# EAGLE design ledboard (EAGLE 5.11)
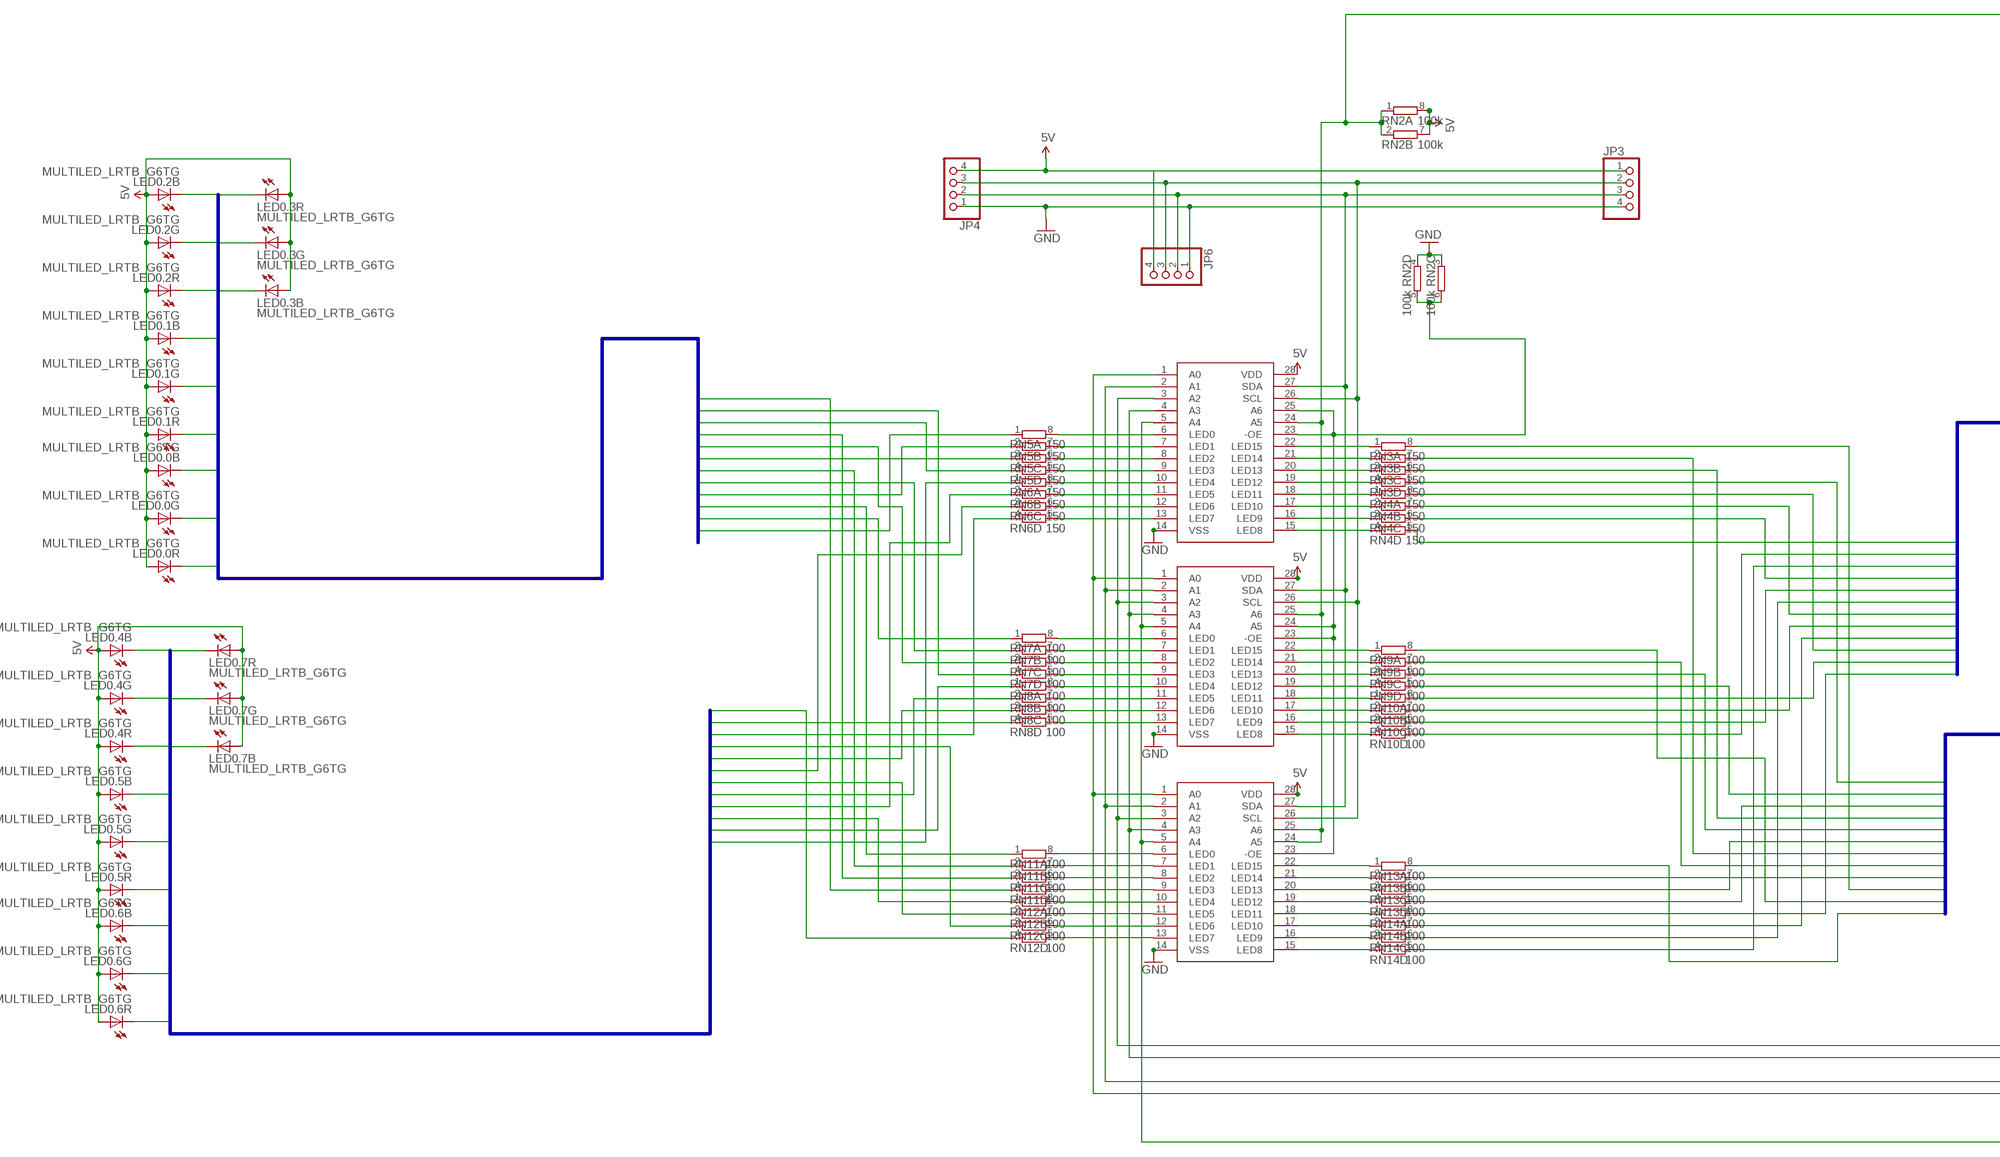
[diagram p0: schematic, sheet 1, part 1 of 2]
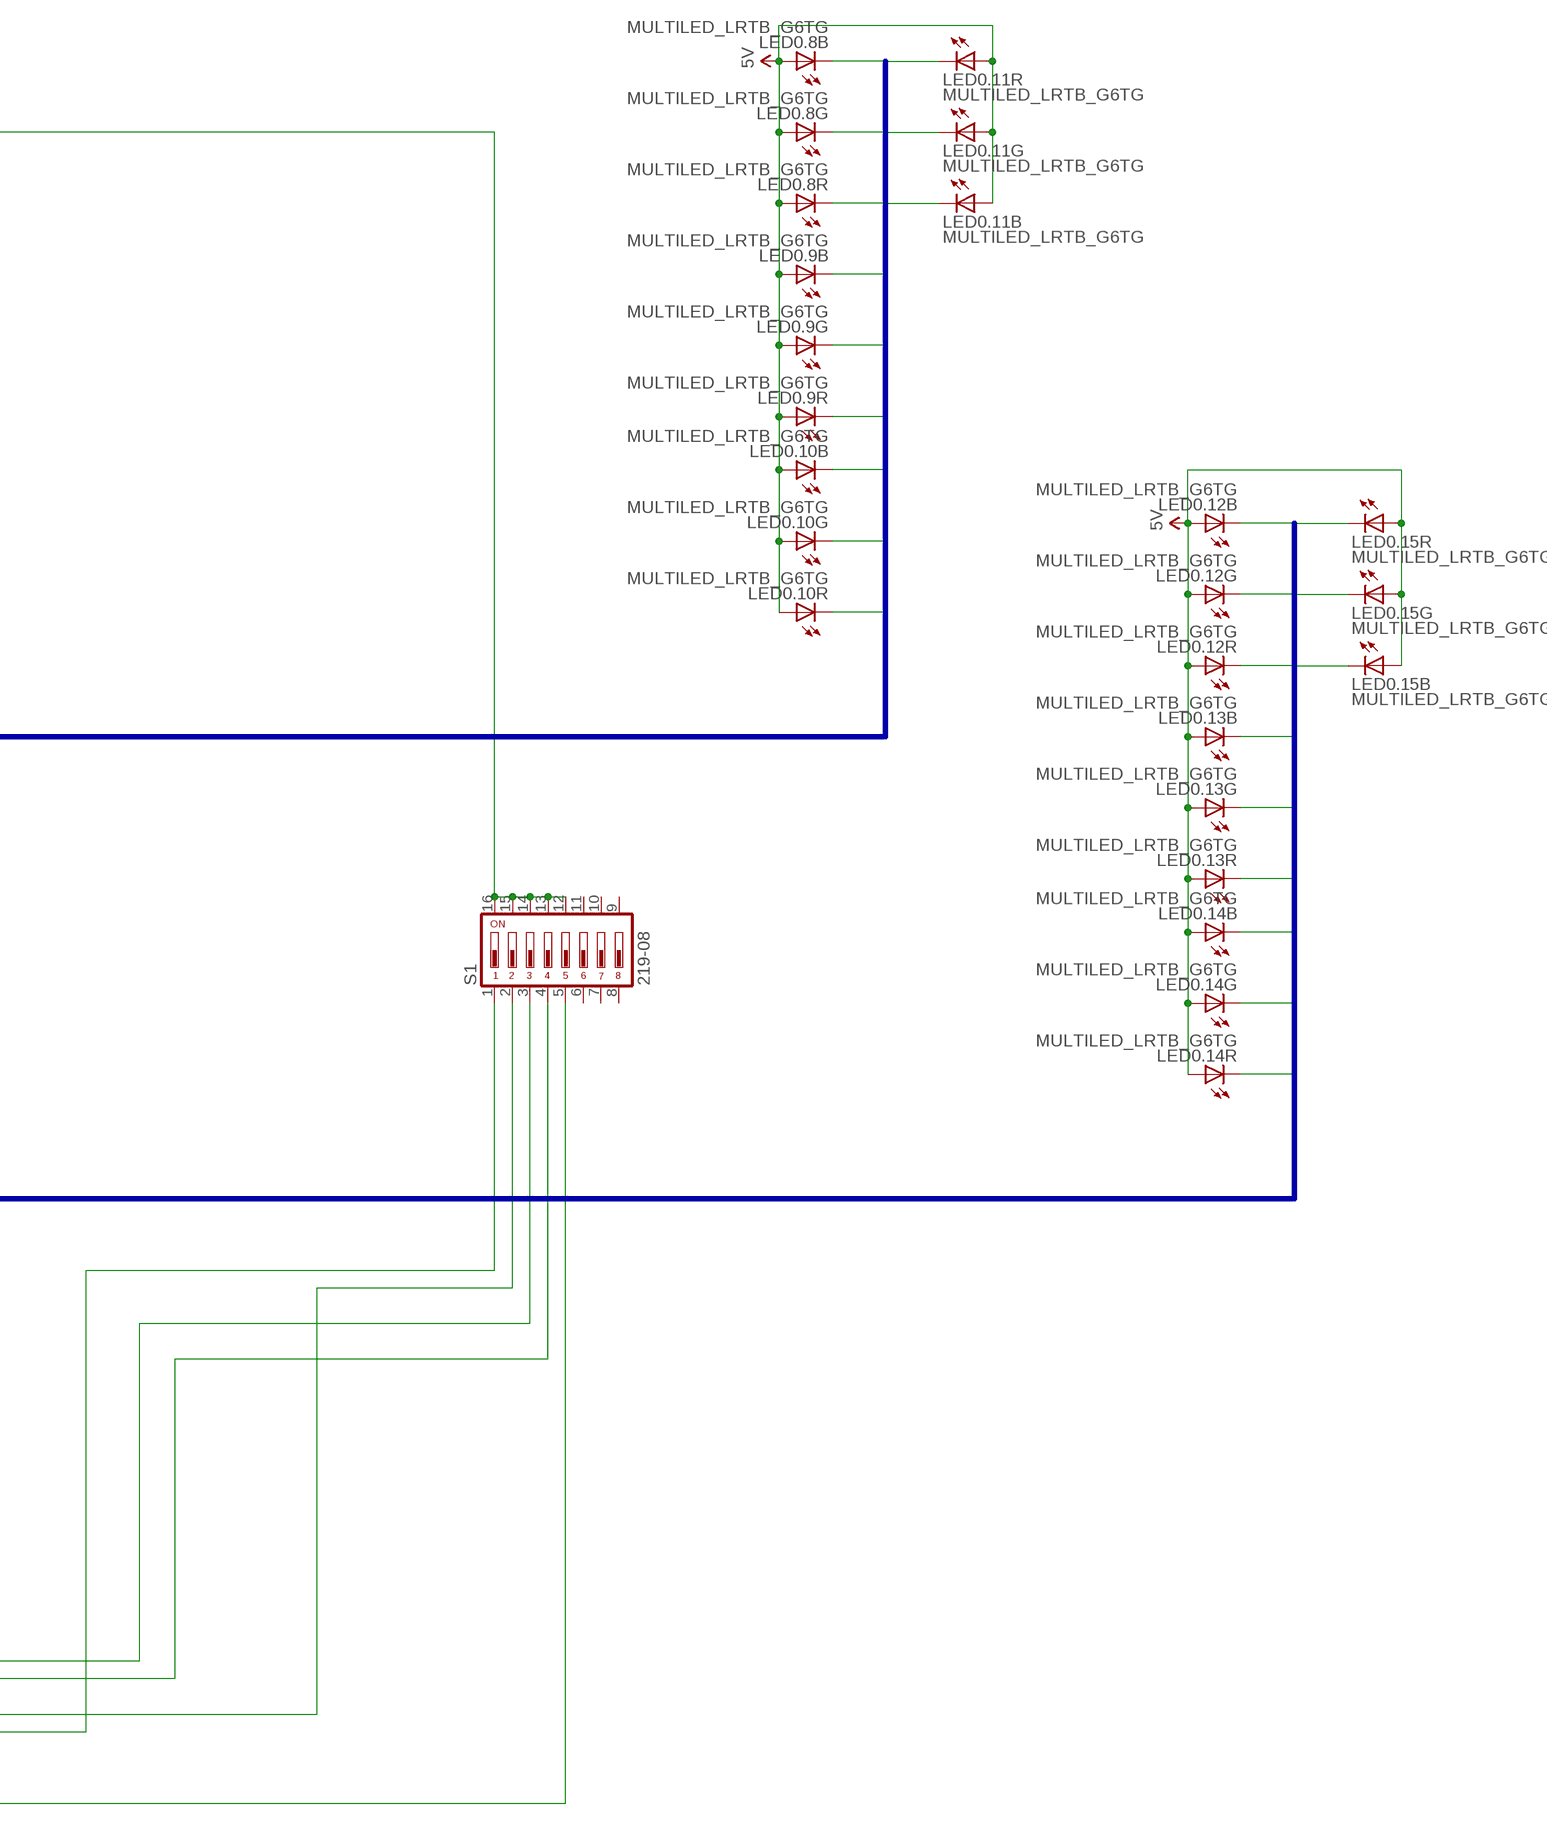
[diagram p1: schematic, sheet 1, part 2 of 2]

## Parts
DRV_B  PCA9635PWPCA9635PW  [TSSOP28]
DRV_G  PCA9635PWPCA9635PW  [TSSOP28]
DRV_R  PCA9635PWPCA9635PW  [TSSOP28]
JP3  PINHD-1X04_2.54-SMD-90°  [1X04SMD/90]
JP4  PINHD-1X04_2.54-SMD-90°  [1X04SMD/90]
JP6  PINHD-1X04_2.54-SMD-90°  [1X04SMD/90]
LED0.0  MULTILED_LRTB_G6TG  [P-LCC-6_TOPLED]
LED0.1  MULTILED_LRTB_G6TG  [P-LCC-6_TOPLED]
LED0.2  MULTILED_LRTB_G6TG  [P-LCC-6_TOPLED]
LED0.3  MULTILED_LRTB_G6TG  [P-LCC-6_TOPLED]
LED0.4  MULTILED_LRTB_G6TG  [P-LCC-6_TOPLED]
LED0.5  MULTILED_LRTB_G6TG  [P-LCC-6_TOPLED]
LED0.6  MULTILED_LRTB_G6TG  [P-LCC-6_TOPLED]
LED0.7  MULTILED_LRTB_G6TG  [P-LCC-6_TOPLED]
LED0.8  MULTILED_LRTB_G6TG  [P-LCC-6_TOPLED]
LED0.9  MULTILED_LRTB_G6TG  [P-LCC-6_TOPLED]
LED0.10  MULTILED_LRTB_G6TG  [P-LCC-6_TOPLED]
LED0.11  MULTILED_LRTB_G6TG  [P-LCC-6_TOPLED]
LED0.12  MULTILED_LRTB_G6TG  [P-LCC-6_TOPLED]
LED0.13  MULTILED_LRTB_G6TG  [P-LCC-6_TOPLED]
LED0.14  MULTILED_LRTB_G6TG  [P-LCC-6_TOPLED]
LED0.15  MULTILED_LRTB_G6TG  [P-LCC-6_TOPLED]
RN2  100k  4R-NCAY16  [CAY16]
RN3  150  4R-NCAY16  [CAY16]
RN4  150  4R-NCAY16  [CAY16]
RN5  150  4R-NCAY16  [CAY16]
RN6  150  4R-NCAY16  [CAY16]
RN7  100  4R-NCAY16  [CAY16]
RN8  100  4R-NCAY16  [CAY16]
RN9  100  4R-NCAY16  [CAY16]
RN10  100  4R-NCAY16  [CAY16]
RN11  100  4R-NCAY16  [CAY16]
RN12  100  4R-NCAY16  [CAY16]
RN13  100  4R-NCAY16  [CAY16]
RN14  100  4R-NCAY16  [CAY16]
S1  219-08  [CTS-219-08]

## Nets
5V: DRV_B.28(VDD) DRV_G.28(VDD) DRV_R.28(VDD) RN2.7 RN2.8
5V_HP [high-power]: JP3.1 JP4.4 JP6.4 ; supply symbol labelled 5V
5V_LED [power]: LED0.0.A1(R:A) LED0.0.A2(G:A) LED0.0.A3(B:A) LED0.1.A1(R:A) LED0.1.A2(G:A) LED0.1.A3(B:A) LED0.2.A1(R:A) LED0.2.A2(G:A) LED0.2.A3(B:A) LED0.3.A1(R:A) LED0.3.A2(G:A) LED0.3.A3(B:A) LED0.4.A1(R:A) LED0.4.A2(G:A) LED0.4.A3(B:A) LED0.5.A1(R:A) LED0.5.A2(G:A) LED0.5.A3(B:A) LED0.6.A1(R:A) LED0.6.A2(G:A) LED0.6.A3(B:A) LED0.7.A1(R:A) LED0.7.A2(G:A) LED0.7.A3(B:A) LED0.8.A1(R:A) LED0.8.A2(G:A) LED0.8.A3(B:A) LED0.9.A1(R:A) LED0.9.A2(G:A) LED0.9.A3(B:A) LED0.10.A1(R:A) LED0.10.A2(G:A) LED0.10.A3(B:A) LED0.11.A1(R:A) LED0.11.A2(G:A) LED0.11.A3(B:A) LED0.12.A1(R:A) LED0.12.A2(G:A) LED0.12.A3(B:A) LED0.13.A1(R:A) LED0.13.A2(G:A) LED0.13.A3(B:A) LED0.14.A1(R:A) LED0.14.A2(G:A) LED0.14.A3(B:A) LED0.15.A1(R:A) LED0.15.A2(G:A) LED0.15.A3(B:A) ; supply symbol labelled 5V
A0: DRV_B.1(A0) DRV_G.1(A0) DRV_R.1(A0) S1.1
A1: DRV_B.2(A1) DRV_G.2(A1) DRV_R.2(A1) S1.2
A2: DRV_B.3(A2) DRV_G.3(A2) DRV_R.3(A2) S1.3
A3: DRV_B.4(A3) DRV_G.4(A3) DRV_R.4(A3) S1.4
A4: DRV_B.5(A4) DRV_G.5(A4) DRV_R.5(A4) S1.5
GND [power]: DRV_B.14(VSS) DRV_G.14(VSS) DRV_R.14(VSS) RN2.3 RN2.4
GND_HP [high-power]: JP3.4 JP4.1 JP6.1 ; supply symbol labelled GND
N$1: DRV_R.6(LED0) RN5.8
N$2: DRV_R.7(LED1) RN5.7
N$3: DRV_R.8(LED2) RN5.6
N$4: DRV_R.9(LED3) RN5.5
N$5: DRV_R.10(LED4) RN6.8
N$6: DRV_R.11(LED5) RN6.7
N$7: DRV_R.12(LED6) RN6.6
N$8: DRV_R.13(LED7) RN6.5
N$9: DRV_R.22(LED15) RN3.1
N$10: DRV_R.21(LED14) RN3.2
N$11: DRV_R.20(LED13) RN3.3
N$12: DRV_R.19(LED12) RN3.4
N$13: DRV_R.18(LED11) RN4.1
N$14: DRV_R.17(LED10) RN4.2
N$15: DRV_R.16(LED9) RN4.3
N$16: DRV_R.15(LED8) RN4.4
N$17: DRV_G.6(LED0) RN7.8
N$18: DRV_G.8(LED2) RN7.6
N$19: DRV_G.7(LED1) RN7.7
N$20: DRV_G.9(LED3) RN7.5
N$21: DRV_G.10(LED4) RN8.8
N$22: DRV_G.11(LED5) RN8.7
N$23: DRV_G.12(LED6) RN8.6
N$24: DRV_G.13(LED7) RN8.5
N$25: DRV_G.22(LED15) RN9.1
N$26: DRV_G.21(LED14) RN9.2
N$27: DRV_G.20(LED13) RN9.3
N$28: DRV_G.19(LED12) RN9.4
N$29: DRV_G.18(LED11) RN10.1
N$30: DRV_G.17(LED10) RN10.2
N$31: DRV_G.16(LED9) RN10.3
N$32: DRV_G.15(LED8) RN10.4
N$33: DRV_B.22(LED15) RN13.1
N$34: DRV_B.21(LED14) RN13.2
N$35: DRV_B.20(LED13) RN13.3
N$36: DRV_B.19(LED12) RN13.4
N$37: DRV_B.18(LED11) RN14.1
N$38: DRV_B.17(LED10) RN14.2
N$39: DRV_B.16(LED9) RN14.3
N$40: DRV_B.15(LED8) RN14.4
N$41: DRV_B.6(LED0) RN11.8
N$42: DRV_B.7(LED1) RN11.7
N$43: DRV_B.8(LED2) RN11.6
N$44: DRV_B.9(LED3) RN11.5
N$45: DRV_B.10(LED4) RN12.8
N$46: DRV_B.11(LED5) RN12.7
N$47: DRV_B.12(LED6) RN12.6
N$48: DRV_B.13(LED7) RN12.5
PULL-DOWN: DRV_B.23(-OE) DRV_G.23(-OE) DRV_G.24(A5) DRV_R.23(-OE) DRV_R.25(A6) RN2.5 RN2.6
PULL-UP: DRV_B.24(A5) DRV_B.25(A6) DRV_G.25(A6) DRV_R.24(A5) RN2.1 RN2.2 S1.12 S1.13 S1.14 S1.15 S1.16
RGB0: LED0.0.C1(R:C) RN5.1
RGB1: LED0.0.C2(G:C) RN7.1
RGB2: LED0.0.C3(B:C) RN11.1
RGB3: LED0.1.C1(R:C) RN5.2
RGB4: LED0.1.C2(G:C) RN7.2
RGB5: LED0.1.C3(B:C) RN11.2
RGB6: LED0.2.C1(R:C) RN5.3
RGB7: LED0.2.C2(G:C) RN7.3
RGB8: LED0.2.C3(B:C) RN11.3
RGB9: LED0.3.C1(R:C) RN5.4
RGB10: LED0.3.C2(G:C) RN7.4
RGB11: LED0.3.C3(B:C) RN11.4
RGB12: LED0.6.C1(R:C) RN6.1
RGB13: LED0.6.C2(G:C) RN8.1
RGB14: LED0.6.C3(B:C) RN12.1
RGB15: LED0.5.C1(R:C) RN6.2
RGB16: LED0.5.C2(G:C) RN8.2
RGB17: LED0.5.C3(B:C) RN12.2
RGB18: LED0.4.C1(R:C) RN6.3
RGB19: LED0.4.C2(G:C) RN8.3
RGB20: LED0.4.C3(B:C) RN12.3
RGB21: LED0.7.C1(R:C) RN6.4
RGB22: LED0.7.C2(G:C) RN8.4
RGB23: LED0.7.C3(B:C) RN12.4
RGB24: LED0.10.C1(R:C) RN4.5
RGB25: LED0.10.C2(G:C) RN10.5
RGB26: LED0.10.C3(B:C) RN14.5
RGB27: LED0.9.C1(R:C) RN4.6
RGB28: LED0.9.C2(G:C) RN10.6
RGB29: LED0.9.C3(B:C) RN14.6
RGB30: LED0.8.C1(R:C) RN4.7
RGB31: LED0.8.C2(G:C) RN10.7
RGB32: LED0.8.C3(B:C) RN14.7
RGB33: LED0.11.C1(R:C) RN4.8
RGB34: LED0.11.C2(G:C) RN10.8
RGB35: LED0.11.C3(B:C) RN14.8
RGB36: LED0.14.C1(R:C) RN3.5
RGB37: LED0.14.C2(G:C) RN9.5
RGB38: LED0.14.C3(B:C) RN13.5
RGB39: LED0.13.C1(R:C) RN3.6
RGB40: LED0.13.C2(G:C) RN9.6
RGB41: LED0.13.C3(B:C) RN13.6
RGB42: LED0.12.C1(R:C) RN3.7
RGB43: LED0.12.C2(G:C) RN9.7
RGB44: LED0.12.C3(B:C) RN13.7
RGB45: LED0.15.C1(R:C) RN3.8
RGB46: LED0.15.C2(G:C) RN9.8
RGB47: LED0.15.C3(B:C) RN13.8
SCL: DRV_B.26(SCL) DRV_G.26(SCL) DRV_R.26(SCL) JP3.2 JP4.3 JP6.3
SDA: DRV_B.27(SDA) DRV_G.27(SDA) DRV_R.27(SDA) JP3.3 JP4.2 JP6.2
Unconnected: S1.6 S1.7 S1.8 S1.9 S1.10 S1.11

## Buses
RGB[0..11]
RGB[11..23]
RGB[24..35]
RGB[36..47]

## Library data of the parts
DRV_B DRV_G DRV_R = SparkFun:PCA9635PW: 16ch PWM led driver, 2.3-5.5V
JP3 JP4 JP6 = pinhead-2:PINHD-1X04: PIN HEADER
LED0.0 LED0.1-LED0.15 = led:MULTILED_LRTB_G6TG: 6-lead MULTILED® Enhanced optical Power LED (ThinFilm® / ThinGaN®) Source. OSRAM - LRTB_G6TG.pdf
RN2-RN14 = resistor-dil:4R-N: Array Chip Resistor Source: RS Component / Phycomp; OC_FARNELL: unknown; OC_NEWARK: unknown
S1 = switch-dil:219-08*: Surface Mount DIP Switch Series 219 SMT CTS Electronic Components Sourc: www.ctscorp.com; OC_FARNELL: unknown; OC_NEWARK: unknown

## Net classes
2 high-power: width 0.381 mm

## Board
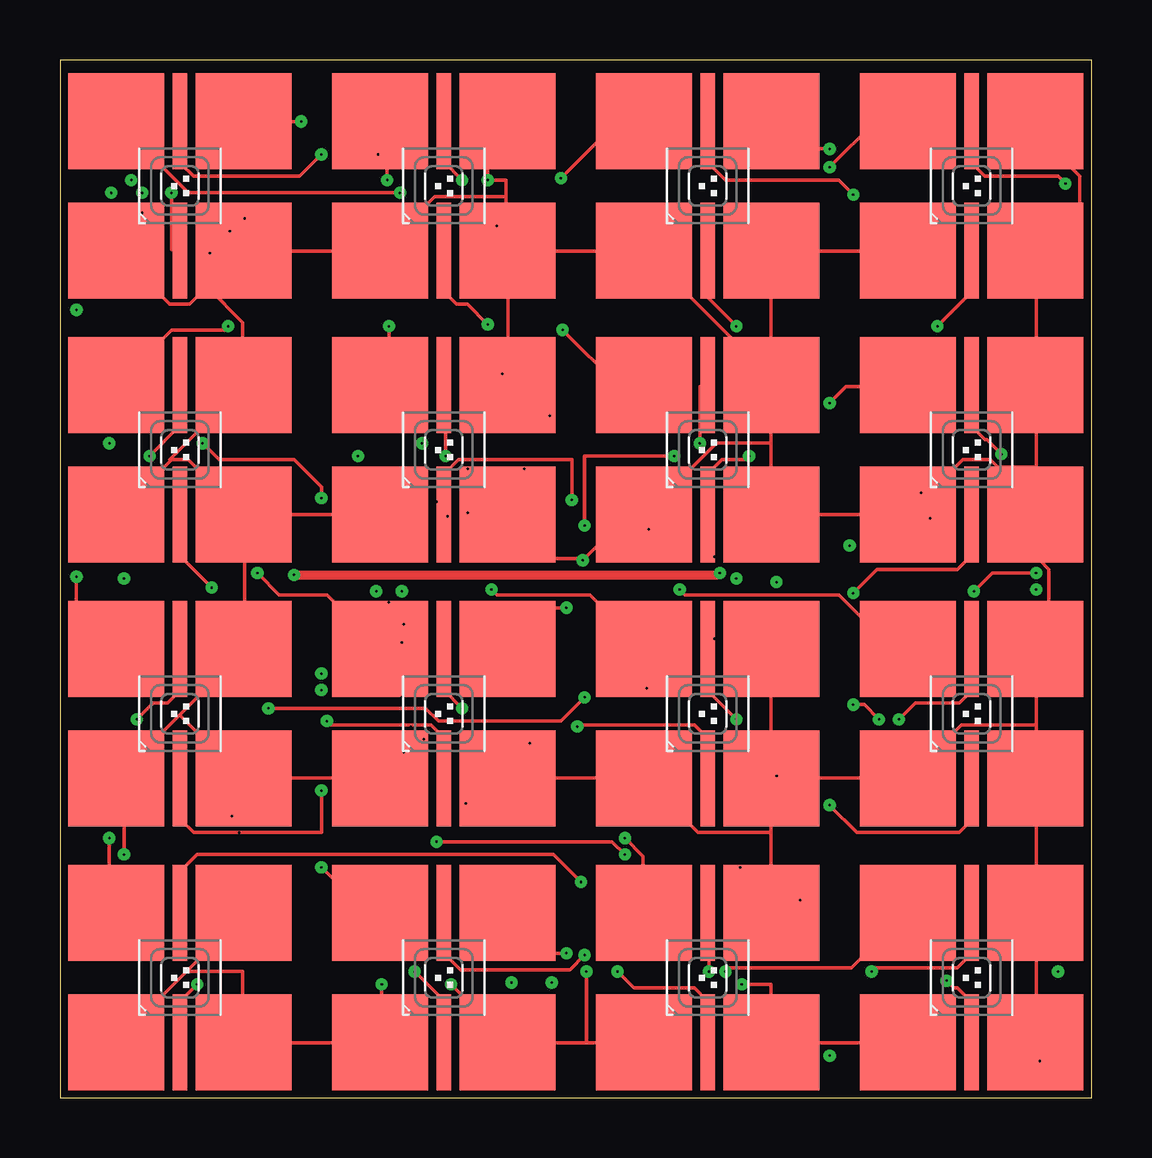
[diagram p2: board, top side]
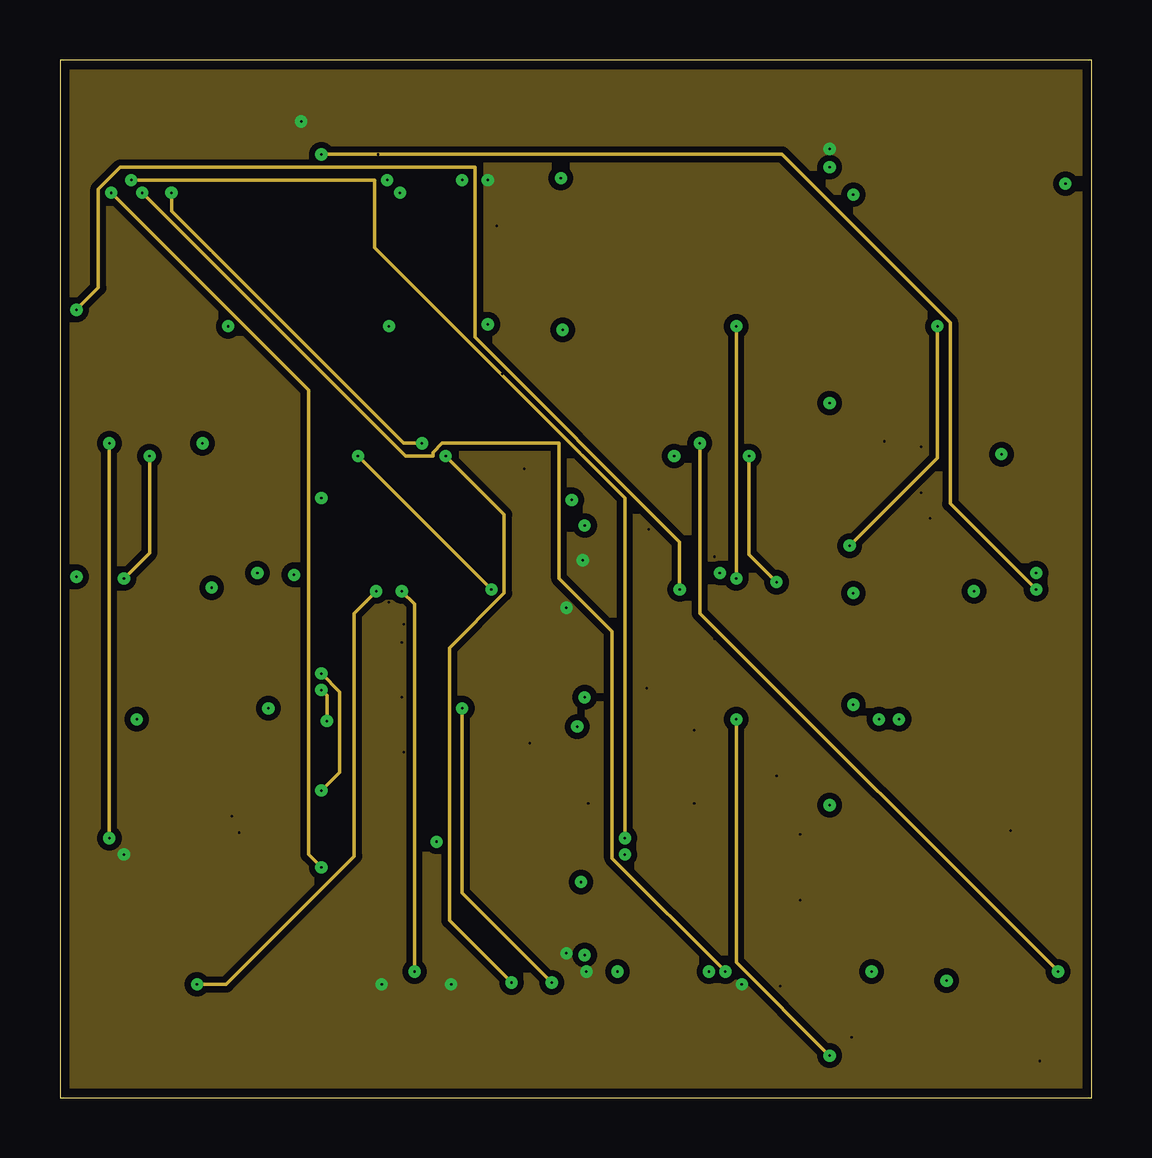
[diagram p3: board, inner layer Route2]
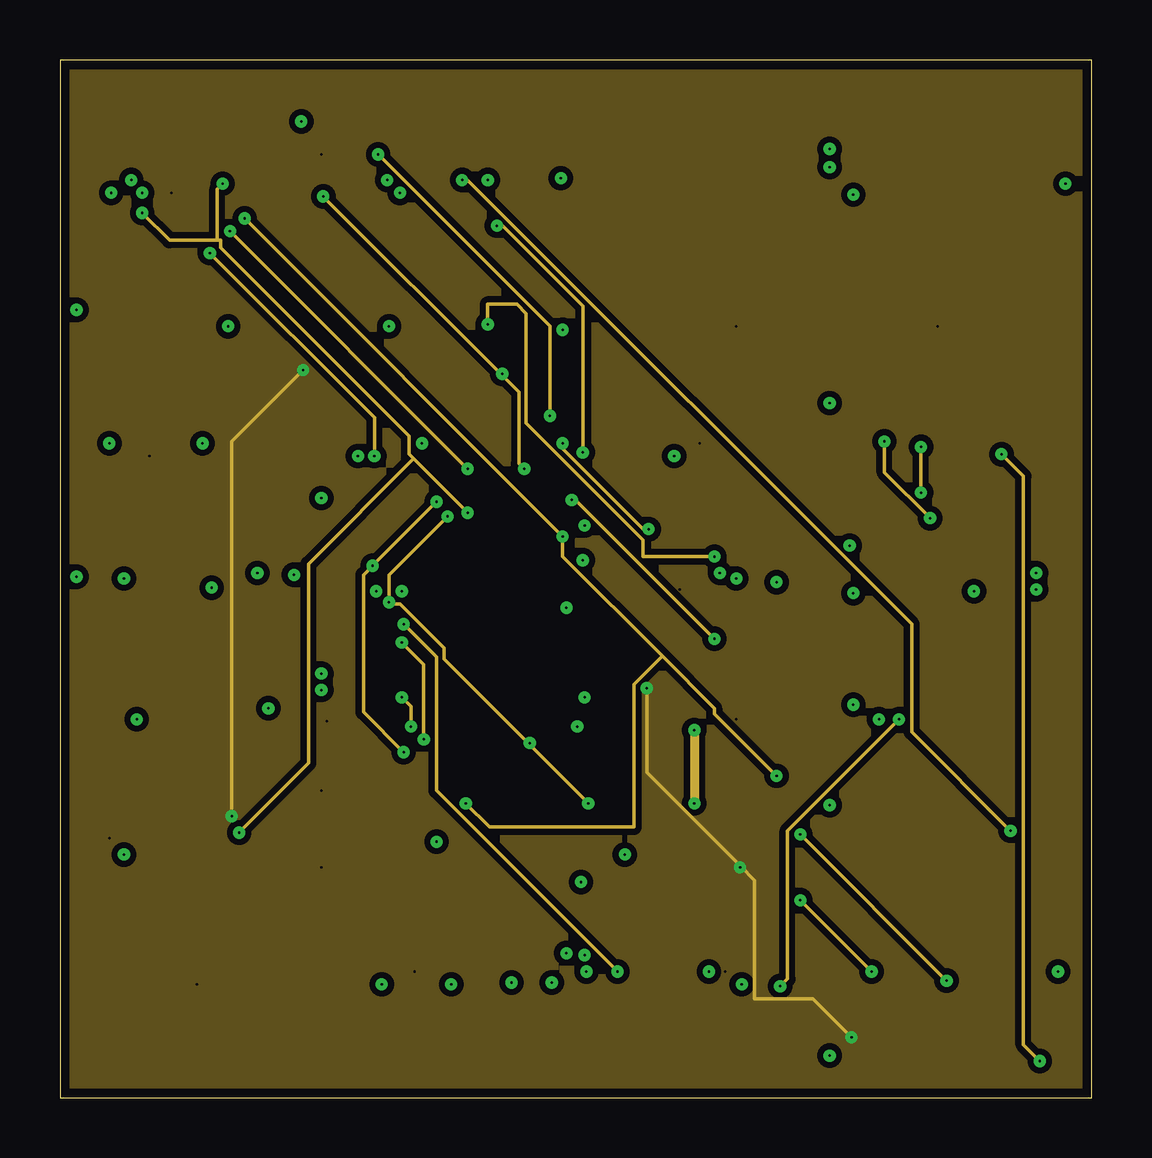
[diagram p4: board, inner layer Route15]
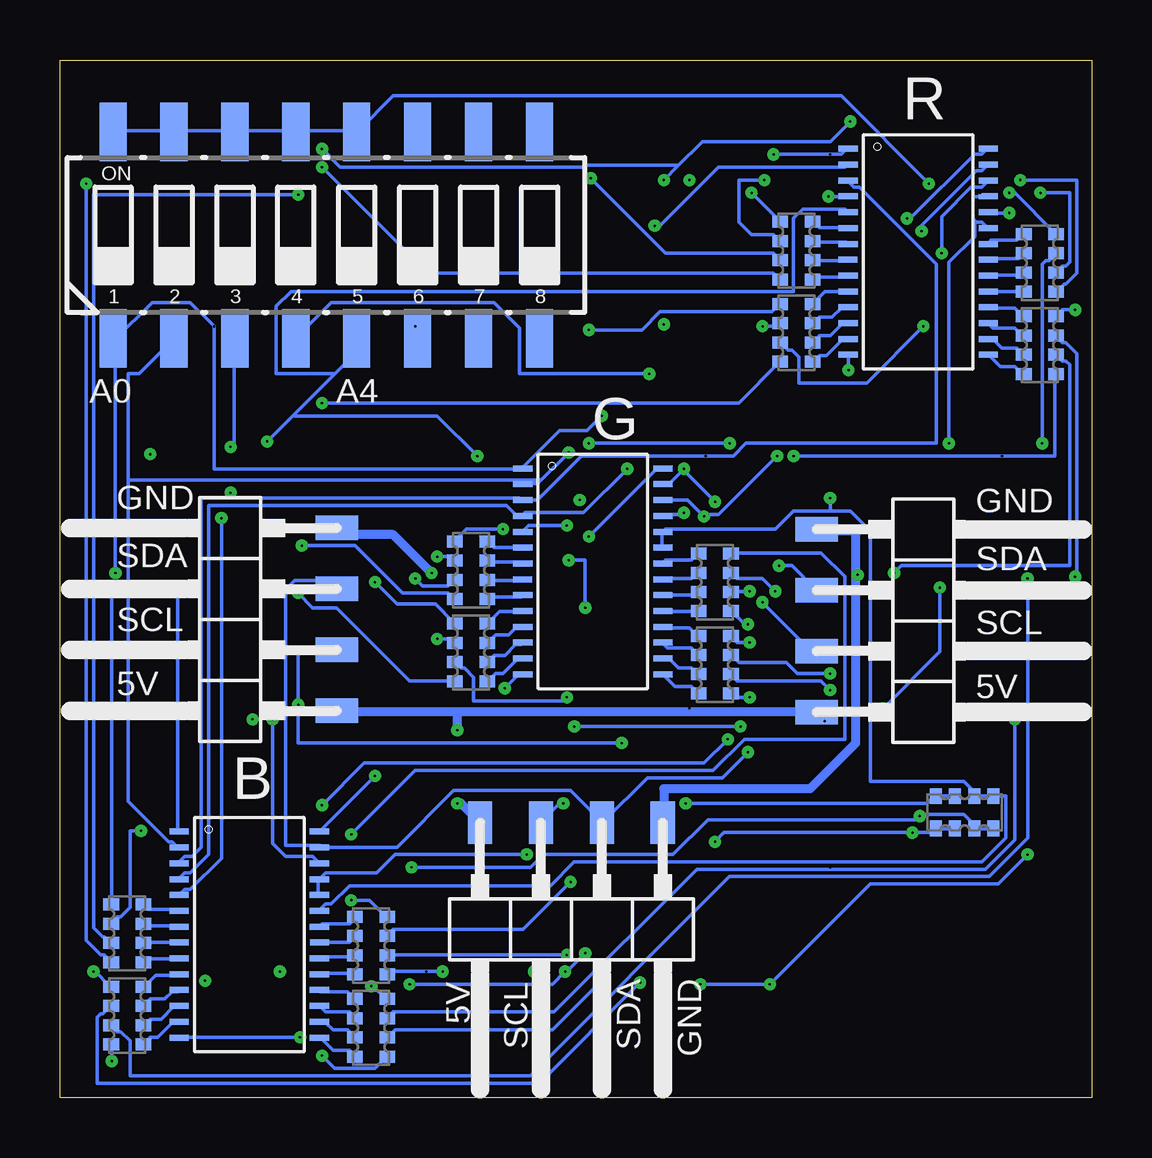
[diagram p5: board, bottom side, seen from below]

Size 43 x 43.26 mm. Coordinates in mm from the lower left corner, seen from the top.
Outline: 0,0 43,0 43,43.26 0,43.26 0,0
Copper layers [2:(1*2+15*16):15]: Top 0.035mm / dielectric 1.5mm / Route2 0.035mm / dielectric 0.15mm / Route15 0.035mm / dielectric 0.2mm / Bottom 0.035mm
Design rules "brandner_4l_6mil": minimum track width 6mil, minimum drill 0.1mm, track to track 6mil, track to pad 6mil, pad to pad 6mil, via to via 6mil, smd to smd 6mil, copper to edge 15mil, drill to drill 10mil, minimum pad ring 10mil, minimum via ring 8mil, stop-mask expansion 4mil, vias tented up to drill 0mil, thermal gap 10mil

### Footprints (pad centres in the part's own frame; a part is rotated, then mirrored left to right if it is on the bottom)
TSSOP28 = smd 0.8 x 0.25: 1 -2.921,4.623; 2 -2.921,3.962; 3 -2.921,3.302; 4 -2.921,2.642; 5 -2.921,1.981; 6 -2.921,1.321; 7 -2.921,0.66; 8 -2.927,0; 9 -2.921,-0.66; 10 -2.921,-1.321; 11 -2.921,-1.981; 12 -2.921,-2.642; 13 -2.921,-3.302; 14 -2.921,-3.962; 15 2.921,-3.962; 16 2.921,-3.302; 17 2.921,-2.642; 18 2.921,-1.981; 19 2.921,-1.321; 20 2.921,-0.66; 21 2.927,0; 22 2.921,0.66; 23 2.921,1.321; 24 2.921,1.981; 25 2.921,2.642; 26 2.921,3.302; 27 2.921,3.962; 28 2.921,4.623
1X04SMD/90 = smd 1.016 x 1.778: 1 -1.27,-5.08; 2 1.27,-5.08; 3 3.81,-5.08; 4 6.35,-5.08
P-LCC-6_TOPLED = smd 4 x 4: A1 -2.65,-2.7; A2 2.65,-2.7; A3 2.65,2.7; C1 -2.65,2.7 | smd 0.6 x 4: C2 0,-2.7; C3 0,2.7
CAY16 = smd 0.5 x 0.65: 1 -1.2,-0.675; 2 -0.4,-0.675; 3 0.4,-0.675; 4 1.2,-0.675; 5 1.2,0.675; 6 0.4,0.675; 7 -0.4,0.675; 8 -1.2,0.675
CTS-219-08 = smd 1.13 x 2.44: 1 -8.89,-4.3; 2 -6.35,-4.3; 3 -3.81,-4.3; 4 -1.27,-4.3; 5 1.27,-4.3; 6 3.81,-4.3; 7 6.35,-4.3; 8 8.89,-4.3; 9 8.89,4.3; 10 6.35,4.3; 11 3.81,4.3; 12 1.27,4.3; 13 -1.27,4.3; 14 -3.81,4.3; 15 -6.35,4.3; 16 -8.89,4.3

### Placement (x,y rotation side)
DRV_B  35.11,6.47 0 bottom
DRV_G  20.79,21.61 0 bottom
DRV_R  7.23,34.93 0 bottom
JP3  36.54,17.4 90 bottom
JP4  6.38,22.42 270 bottom
JP6  19.14,6.38 180 bottom
LED0.0  5,38 0 top
LED0.1  16,38 0 top
LED0.2  27,38 0 top
LED0.3  38,38 0 top
LED0.4  5,27 0 top
LED0.5  16,27 0 top
LED0.6  27,27 0 top
LED0.7  38,27 0 top
LED0.8  5,16 0 top
LED0.9  16,16 0 top
LED0.10  27,16 0 top
LED0.11  38,16 0 top
LED0.12  5,5 0 top
LED0.13  16,5 0 top
LED0.14  27,5 0 top
LED0.15  38,5 0 top
RN2  5.29,11.9 0 bottom
RN3  2.15,34.8 270 bottom
RN4  2.15,31.37 270 bottom
RN5  12.31,35.31 270 bottom
RN6  12.31,31.88 270 bottom
RN7  25.87,21.99 270 bottom
RN8  25.87,18.56 270 bottom
RN9  15.71,21.48 270 bottom
RN10  15.71,18.05 270 bottom
RN11  40.19,6.85 270 bottom
RN12  40.19,3.42 270 bottom
RN13  30.03,6.34 270 bottom
RN14  30.03,2.91 270 bottom
S1  31.9,35.96 0 bottom

### Tracks (layer width: path | path; a pad name or v marks a point on that pad's centre or on a via)
5V  (via drill 0.1 layers 15-16)
  Route15 0.152: v29.87,13.41 27.28,16 27.28,16.23 25.11,18.4 | 25.11,18.4 20.95,22.55 v20.95,23.39 v7.7,36.65 | v16.92,12.27 17.91,11.28 23.93,11.28 23.93,17.22 25.11,18.4
  Bottom 0.152: RN2.7 5.71,12.57 6.48,12.57 RN2.8 6.55,12.57 6.86,12.27 v16.92,12.27 | v29.87,13.41 32.16,11.12 DRV_B.28 | v20.95,23.39 18.14,26.21 17.91,26.21 DRV_G.28 | v7.7,36.65 7.54,36.65 4.88,39.32 4.57,39.32 4.34,39.55 DRV_R.28
5V_HP  (via drill 0.1 layers 15-16)
  Route15 0.381: v26.44,15.32 v26.44,12.27
  Bottom 0.381: 26.44,16.08 31.39,16.08 JP3.1 | 26.44,16.08 11.51,16.08 JP4.4 | v26.44,12.27 26.29,12.27 25.53,11.51 JP6.4 | 26.44,16.08 v26.44,15.32
5V_LED  (via drill 0.1)
  Top 0.152: v21.11,20.42 20.34,20.42 18.67,18.75 LED0.9.A3 | LED0.5.A2 18.67,24.23 20.42,22.48 21.79,22.48 v21.79,22.4 23.62,24.23 24.31,24.23 LED0.6.A1 24.38,24.31 27.36,27.28 29.64,27.28 | 29.64,27.28 29.64,29.64 LED0.6.A3 | 29.64,27.28 LED0.6.A2 29.72,24.31 35.28,24.31 LED0.7.A1 37.64,26.59 38.79,26.59 39.09,26.29 40.69,26.29 | 29.64,31.62 29.64,29.72 LED0.6.A3 | 29.64,31.62 29.64,35.28 LED0.2.A2 29.72,35.28 35.28,35.28 LED0.3.A1 | 40.69,26.29 40.69,29.64 LED0.7.A3 40.69,29.72 40.69,35.28 LED0.3.A2 40.69,35.36 42.52,35.36 42.52,38.41 42.14,38.79 42.14,40.69 40.69,40.69 LED0.3.A3 | 40.69,26.29 40.69,24.31 LED0.7.A2 | LED0.15.A2 40.69,2.36 40.69,7.7 LED0.15.A3 40.69,7.77 40.69,13.26 LED0.11.A2 40.69,13.34 40.69,15.54 | 40.69,15.54 40.69,18.67 LED0.11.A3 40.69,18.75 41.22,18.75 41.22,22.02 40.84,22.4 40.69,22.4 40.69,24.23 LED0.7.A2 | LED0.9.A2 18.67,13.34 24.31,13.34 LED0.10.A1 24.38,13.26 26.59,11.05 29.64,11.05 | 29.64,11.05 29.64,13.26 LED0.10.A2 | 29.64,11.05 29.64,7.77 LED0.14.A3 | LED0.10.A3 29.64,18.67 29.64,13.34 LED0.10.A2 | LED0.10.A2 29.72,13.34 35.28,13.34 LED0.11.A1 35.36,13.34 37.57,15.54 40.69,15.54 | 40.69,26.29 LED0.7.A2 | 5.3,5.3 7.7,7.7 LED0.12.A3 | 5.3,5.3 2.36,2.36 LED0.12.A1 | 5.3,5.3 5.33,5.26 7.62,5.26 7.62,2.36 LED0.12.A2 7.7,2.29 13.34,2.29 LED0.13.A1 13.41,2.36 v13.41,4.72 | LED0.15.A1 35.28,2.29 29.72,2.29 LED0.14.A2 29.64,2.36 29.64,4.72 v28.42,4.72 | 21.95,2.29 24.31,2.29 LED0.14.A1 | 21.95,2.29 18.67,2.29 LED0.13.A2 18.67,2.36 v16.31,4.72 | v21.11,6.02 20.34,6.02 18.67,7.7 LED0.13.A3 | 21.95,2.29 v21.95,5.26 | 4.99,15.96 7.7,18.67 LED0.8.A3 7.7,18.75 7.7,24.23 LED0.4.A2
  Top 0.152: 4.99,15.96 2.36,13.34 LED0.8.A1 2.36,13.26 2.67,13.26 v2.67,10.13 | 4.99,15.96 7.62,13.34 LED0.8.A2 7.7,13.34 13.34,13.34 LED0.9.A1 | LED0.0.A1 2.36,35.28 4.57,33.07 5.41,33.07 7.62,35.28 LED0.0.A2 | LED0.0.A2 7.7,35.28 13.34,35.28 LED0.1.A1 13.41,35.36 15.62,37.57 18.59,37.57 | 4.61,26.56 4.65,26.59 5.33,26.59 7.62,24.31 LED0.4.A2 | 4.61,26.56 2.36,24.31 LED0.4.A1 | LED0.5.A1 13.34,24.31 7.7,24.31 LED0.4.A2 | 4.61,26.56 4.57,26.59 7.62,29.64 LED0.4.A3 7.62,29.72 7.62,32.31 6.17,33.76 LED0.0.A2 | LED0.5.A3 18.67,29.72 18.67,35.28 LED0.1.A2 | LED0.1.A2 18.75,35.28 24.31,35.28 LED0.2.A1 24.38,35.28 28.04,31.62 29.64,31.62 | v10.06,40.69 7.7,40.69 LED0.0.A3 | LED0.1.A3 18.59,40.69 17.83,40.69 v17.83,38.25 18.59,38.25 18.59,37.57 | v32.08,39.55 30.86,39.55 29.72,40.69 LED0.2.A3 | 18.59,37.57 18.59,35.36 LED0.1.A2 | 29.64,31.62 LED0.6.A3
  Bottom 0.152: v21.11,20.42 21.11,22.4 v21.79,22.4 | v21.11,6.02 21.87,5.26 v21.95,5.26 22.48,4.72 v28.42,4.72 | v16.31,4.72 v13.41,4.72 9.22,8.91 3.89,8.91 v2.67,10.13 | v10.06,40.69 10.9,39.85 16.23,39.85 17.26,38.82 | v17.83,38.25 17.26,38.82 | v32.08,39.55 31.32,38.79 21.11,38.79 21.03,38.86 17.3,38.86 17.26,38.82
  pour Route2 (isolate 0.254): 0,42.92 0,0 42.92,0 42.92,42.92
A0  (via drill 0.1, 0.1 layers 15-16)
  Top 0.152: v38.1,21.11 38.86,21.87 v40.69,21.87
  Route15 0.152: v13.26,39.32 20.42,32.16 v20.42,28.42
  Bottom 0.152: v38.1,21.11 38.1,11.12 DRV_B.1 | 40.69,31.62 v40.69,21.87 | 40.69,31.62 40.77,31.62 S1.1 40.69,31.62 | v13.26,39.32 10.44,39.32 10.21,39.55 DRV_R.1 | v20.42,28.42 21.03,27.81 22.17,27.81 23.7,26.29 DRV_G.1 23.77,26.21 36.58,26.21 36.58,32.16 37.57,33.15 39.17,33.15 40.69,31.62
A1  (via drill 0.1 layers 15-16)
  Route15 0.152: v18.21,36.35 18.44,36.35 21.79,32.99 v21.79,26.9
  Bottom 0.152: 40.16,25.76 40.16,30.18 39.7,30.18 38.25,31.62 S1.2 | 40.16,25.76 40.16,12.34 38.48,10.67 38.33,10.67 38.1,10.44 DRV_B.2 | v18.21,36.35 17.98,36.35 15.54,38.79 10.29,38.79 10.21,38.86 DRV_R.2 | 22.97,25.72 23.09,25.6 23.7,25.6 DRV_G.2 | v21.79,26.9 22.97,25.72 | 40.16,25.76 23.01,25.76 22.97,25.72
A2  (via drill 0.1 layers 15-16)
  Route15 0.152: v35.89,25.22 v35.89,27.13
  Bottom 0.152: 35.89,24.99 23.85,24.99 23.77,24.92 DRV_G.3 23.7,24.92 23.09,24.92 21.26,26.75 14.94,26.75 14.4,27.28 6.48,27.28 6.48,34.75 9.68,37.95 9.91,37.95 10.13,38.18 DRV_R.3 | 35.89,24.99 37.11,24.99 37.11,10.44 37.49,10.06 37.8,10.06 38.02,9.83 DRV_B.3 | v35.89,27.13 35.74,27.13 35.74,31.62 S1.3 | 35.89,24.99 v35.89,25.22
A3  (via drill 0.1 layers 15-16)
  Route15 0.152: 18.4,30.14 19.13,29.41 19.13,26.44 v19.36,26.21 | v10.97,37.57 18.4,30.14 | 18.4,30.14 v18.44,30.18
  Bottom 0.152: v10.97,37.57 10.21,37.57 DRV_R.4 | v19.36,26.21 21.18,24.38 23.62,24.38 23.7,24.31 DRV_G.4 23.77,24.31 24,24.31 24.38,24.69 36.8,24.69 36.8,10.13 37.57,9.37 37.8,9.37 38.02,9.14 DRV_B.4 | v18.44,30.18 23.85,30.18 23.85,32.08 24.92,33.15 31.7,33.15 33.15,31.7 S1.4
A4  (via drill 0.1, 0.1 layers 15-16)
  Top 0.152: v21.87,23.85 21.87,26.75 v25.6,26.75
  Route15 0.152: v36.27,24.16 34.37,26.06 v34.37,27.36
  Bottom 0.152: v36.27,24.16 36.27,9.98 37.57,8.69 37.8,8.69 DRV_B.5 | 31.59,30.14 30.63,31.09 30.63,31.62 S1.5 | 33.26,28.46 31.59,30.14 | v34.37,27.36 33.26,28.46 | DRV_R.5 10.21,36.96 10.29,37.03 12.04,37.03 12.42,36.65 12.42,33.6 33.38,33.6 33.98,32.99 33.98,30.18 31.62,30.18 31.59,30.14 | v21.87,23.85 23.47,23.85 23.7,23.62 DRV_G.5 | v25.6,26.75 27.28,28.42 33.22,28.42 33.26,28.46
GND  (via drill 0.1 layers 15-16)
  Route15 0.152: v10.13,30.33 7.16,27.36 v7.16,11.73 | v32.99,2.52 31.39,4.12 28.96,4.12 28.96,9.07 28.38,9.64 | 28.38,9.64 24.46,13.56 v24.46,17.07 | v28.35,9.6 28.38,9.64
  Bottom 0.152: 4.72,11.2 4.88,11.2 RN2.3 4.72,11.2 | 4.72,11.2 4.12,11.2 RN2.4 | v10.13,30.33 10.13,30.94 DRV_R.14 | 4.72,11.2 5.33,11.81 7.09,11.81 v7.16,11.73 7.32,11.58 16,11.58 17.45,10.13 22.86,10.13 23.39,9.6 v28.35,9.6 | v32.99,2.52 DRV_B.14 | v24.46,17.07 23.93,17.6 23.77,17.6 DRV_G.14
  pour Route15 (isolate 0.254): 0,42.92 0,0 42.92,0 42.92,42.92
GND_HP  (via drill 0.1)
  Top 0.381: v27.51,21.87 27.43,21.79 v9.75,21.79
  Bottom 0.381: 9.83,21.79 9.83,23.62 11.43,23.62 JP4.1 | 9.83,21.79 9.83,14.78 11.73,12.88 17.83,12.88 17.83,11.51 JP6.1 | v27.51,21.87 29.11,23.47 31.17,23.47 31.39,23.7 JP3.4 | 9.83,21.79 v9.75,21.79
N$1
  Bottom 0.152: RN5.8 11.58,36.5 11.35,36.27 10.21,36.27 DRV_R.6
N$2
  Bottom 0.152: RN5.7 11.58,35.66 10.21,35.66 DRV_R.7
N$3
  Bottom 0.152: RN5.6 11.58,34.9 10.21,34.9 DRV_R.8
N$4
  Bottom 0.152: RN5.5 11.58,34.14 11.51,34.21 10.21,34.21 DRV_R.9
N$5
  Bottom 0.152: RN6.8 11.58,33.15 11.12,33.6 10.21,33.6 DRV_R.10
N$6
  Bottom 0.152: RN6.7 11.58,32.31 11.35,32.54 10.82,32.54 10.44,32.92 10.21,32.92 DRV_R.11
N$7
  Bottom 0.152: RN6.6 11.58,31.55 11.35,31.77 10.9,31.77 10.44,32.23 10.21,32.23 DRV_R.12
N$8
  Bottom 0.152: RN6.5 11.58,30.71 11.35,30.94 11.05,30.94 10.36,31.62 10.21,31.62 DRV_R.13
N$9
  Bottom 0.152: RN3.1 2.9,35.97 3.12,35.74 4.19,35.74 4.27,35.66 DRV_R.22
N$10
  Bottom 0.152: RN3.2 2.9,35.13 3.05,34.98 4.27,34.98 DRV_R.21
N$11
  Bottom 0.152: RN3.3 2.9,34.37 2.97,34.29 4.27,34.29 DRV_R.20
N$12
  Bottom 0.152: RN3.4 2.9,33.6 4.27,33.6 DRV_R.19
N$13
  Bottom 0.152: RN4.1 2.9,32.61 3.2,32.92 4.27,32.92 DRV_R.18
N$14
  Bottom 0.152: RN4.2 2.9,31.77 3.2,32.08 4.12,32.08 4.27,32.23 DRV_R.17
N$15
  Bottom 0.152: RN4.3 2.9,31.01 3.12,31.24 3.73,31.24 4.12,31.62 4.27,31.62 DRV_R.16
N$16
  Bottom 0.152: RN4.4 2.9,30.18 3.2,30.48 3.81,30.48 4.27,30.94 DRV_R.15
N$17
  Bottom 0.152: RN7.8 25.15,23.16 24.92,22.94 23.77,22.94 DRV_G.6
N$18
  Bottom 0.152: RN7.6 25.15,21.57 23.77,21.57 DRV_G.8
N$19
  Bottom 0.152: RN7.7 25.15,22.33 23.77,22.33 DRV_G.7
N$20
  Bottom 0.152: RN7.5 25.15,20.8 25.07,20.88 23.77,20.88 DRV_G.9
N$21
  Bottom 0.152: RN8.8 25.15,19.81 24.69,20.27 23.77,20.27 DRV_G.10
N$22
  Bottom 0.152: RN8.7 25.15,18.97 24.84,19.28 24.31,19.28 24,19.58 23.77,19.58 DRV_G.11
N$23
  Bottom 0.152: RN8.6 25.15,18.21 24.92,18.44 24.46,18.44 24,18.9 23.77,18.9 DRV_G.12
N$24
  Bottom 0.152: RN8.5 25.15,17.37 24.84,17.68 24.54,17.68 23.93,18.29 23.77,18.29 DRV_G.13
N$25
  Bottom 0.152: RN9.1 16.46,22.63 16.69,22.4 17.75,22.4 17.83,22.33 DRV_G.22
N$26
  Bottom 0.152: RN9.2 16.46,21.87 16.69,21.64 17.83,21.64 DRV_G.21
N$27
  Bottom 0.152: RN9.3 16.46,21.03 16.54,20.95 17.83,20.95 DRV_G.20
N$28
  Bottom 0.152: RN9.4 16.46,20.27 17.83,20.27 DRV_G.19
N$29
  Bottom 0.152: RN10.1 16.46,19.28 16.76,19.58 17.83,19.58 DRV_G.18
N$30
  Bottom 0.152: RN10.2 16.46,18.52 16.69,18.75 17.68,18.75 17.83,18.9 DRV_G.17
N$31
  Bottom 0.152: RN10.3 16.46,17.68 16.69,17.91 17.22,17.91 17.6,18.29 17.83,18.29 DRV_G.16
N$32
  Bottom 0.152: RN10.4 16.46,16.92 16.69,17.14 17.37,17.14 17.83,17.6 DRV_G.15
N$33
  Bottom 0.152: RN13.1 30.71,7.47 30.94,7.24 32.08,7.24 32.16,7.16 DRV_B.22
N$34
  Bottom 0.152: RN13.2 30.71,6.71 30.94,6.48 32.16,6.48 DRV_B.21
N$35
  Bottom 0.152: RN13.3 30.71,5.87 32.16,5.87 DRV_B.20
N$36
  Bottom 0.152: RN13.4 30.71,5.18 32.16,5.18 DRV_B.19
N$37
  Bottom 0.152: RN14.1 31.01,4.42 32.16,4.42 DRV_B.18
N$38
  Bottom 0.152: RN14.2 30.71,3.35 30.94,3.58 31.93,3.58 32.16,3.81 DRV_B.17
N$39
  Bottom 0.152: RN14.3 31.01,2.82 31.62,2.82 31.93,3.12 32.16,3.12 DRV_B.16
N$40
  Bottom 0.152: RN14.4 30.71,1.75 30.94,1.98 31.62,1.98 32.08,2.44 32.16,2.44 DRV_B.15
N$41
  Bottom 0.152: RN11.8 39.47,8 39.32,7.85 38.1,7.85 DRV_B.6
N$42
  Bottom 0.152: RN11.7 39.47,7.24 39.4,7.16 38.1,7.16 DRV_B.7
N$43
  Bottom 0.152: RN11.6 39.47,6.48 38.1,6.48 DRV_B.8
N$44
  Bottom 0.152: RN11.5 39.47,5.71 39.4,5.79 38.1,5.79 DRV_B.9
N$45
  Bottom 0.152: RN12.8 39.47,4.65 39.01,5.11 38.1,5.11 DRV_B.10
N$46
  Bottom 0.152: RN12.7 39.47,3.89 39.24,4.12 38.63,4.12 38.33,4.42 38.1,4.42 DRV_B.11
N$47
  Bottom 0.152: RN12.6 39.47,3.05 39.24,3.28 38.79,3.28 38.25,3.81 38.1,3.81 DRV_B.12
N$48
  Bottom 0.152: RN12.5 39.47,2.29 39.24,2.52 38.94,2.52 38.33,3.12 38.1,3.12 DRV_B.13
PULL-DOWN  (via drill 0.1)
  Top 0.152: v5.94,27.28 6.63,26.59 9.75,26.59 10.9,25.45 v10.9,24.99
  Bottom 0.152: 4.84,36.54 4.95,36.65 4.95,37.57 4.34,37.57 DRV_R.25 | 4.84,36.54 4.8,36.5 4.57,36.5 4.34,36.27 DRV_R.23 | DRV_G.23 17.91,22.94 17.91,23.55 DRV_G.24 17.83,23.62 17.75,23.7 13.18,23.7 12.42,24.46 10.9,24.46 | 4.72,12.57 4.88,12.57 RN2.6 4.72,12.57 | 4.72,12.57 4.12,12.57 RN2.5 4.04,12.57 3.58,12.57 3.58,10.82 4.57,9.83 21.57,9.83 22.55,8.84 30.94,8.84 31.7,8.08 31.93,8.08 32.16,7.85 DRV_B.23 | 10.9,24.46 10.06,24.46 9.22,23.62 9.22,13.18 5.33,13.18 4.72,12.57 | v5.94,27.28 5.94,34.82 4.88,35.89 4.88,36.5 4.84,36.54 | 10.9,24.46 v10.9,24.99
PULL-UP  (via drill 0.1, 0.1 layers 15-16)
  Top 0.152: v23.55,10.13 23.01,10.67 v15.7,10.67
  Route15 0.152: v3.43,36.88 4.57,35.74 6.55,35.74 | 6.55,35.74 6.71,35.74 6.71,35.43 14.55,27.58 14.55,26.82 14.74,26.63 | 14.74,26.63 v16.99,24.38 | v7.47,11.05 10.36,13.95 10.36,22.25 14.74,26.63 | v6.78,38.1 6.55,37.87 6.55,35.74
  Bottom 0.152: S1.16 40.77,40.31 38.25,40.31 S1.15 38.18,40.31 35.74,40.31 S1.14 35.66,40.31 33.22,40.31 S1.13 33.15,40.31 30.63,40.31 S1.12 30.56,40.31 29.11,41.76 10.44,41.76 v6.78,38.1 | DRV_B.24 32.23,8.46 32.23,9.07 DRV_B.25 32.16,9.14 31.93,9.37 29.79,9.37 29.03,10.13 v23.55,10.13 | RN2.2 5.71,11.2 6.48,11.2 RN2.1 6.55,11.2 6.71,11.05 v7.47,11.05 15.32,11.05 v15.7,10.67 | v3.43,36.88 4.27,36.88 DRV_R.24 | v16.99,24.38 17.07,24.31 17.83,24.31 DRV_G.25
RGB0  (via drill 0.1)
  Top 0.152: v14.17,37.72 5.33,37.72 2.36,40.69 LED0.0.C1
  Bottom 0.152: v14.17,37.72 13.03,36.58 RN5.1
RGB1  (via drill 0.1, 0.1 layers 1-2, 0.1 layers 15-16)
  Top 0.152: v4.65,37.72 4.65,35.36 4.95,35.36 LED0.0.C2
  Route2 0.152: v15.09,27.28 14.33,27.28 4.65,36.96 v4.65,37.72
  Route15 0.152: v24.54,23.7 24.31,23.7 20.95,27.05 v20.95,27.28
  Bottom 0.152: v24.54,23.7 26.06,23.7 26.52,23.24 RN7.1 | v15.09,27.28 v20.95,27.28
RGB2  (via drill 0.1, 0.1 layers 1-2)
  Top 0.152: v10.9,39.32 9.98,38.41 5.56,38.41 5.03,38.94 5.03,40.69 LED0.0.C3
  Route2 0.152: v40.69,21.18 37.11,24.77 37.11,32.31 30.1,39.32 v10.9,39.32
  Bottom 0.152: v40.69,21.18 40.84,21.18 40.84,8.08 RN11.1
RGB3  (via drill 0.1)
  Top 0.152: v13.64,38.25 13.64,40.69 13.41,40.69 LED0.1.C1
  Bottom 0.152: v13.64,38.25 14.71,38.25 14.71,36.5 14.17,35.97 13.26,35.97 13.03,35.74 RN5.2
RGB4  (via drill 0.1, 0.1 layers 15-16)
  Top 0.152: v17.83,32.23 16.99,33.07 16.54,33.07 16,33.6 16,35.28 LED0.1.C2
  Route15 0.152: v27.28,22.55 24.31,22.55 24.31,23.24 19.43,28.12 19.43,32.69 19.05,33.07 17.83,33.07 v17.83,32.23
  Bottom 0.152: v27.28,22.55 26.75,22.55 26.59,22.4 RN7.2
RGB5  (via drill 0.1, 0.1 layers 15-16)
  Top 0.152: v16.76,38.25 16,39.01 LED0.1.C3
  Route15 0.152: v39.62,11.12 35.51,15.24 35.51,19.74 16.99,38.25 v16.76,38.25
  Bottom 0.152: v39.62,11.12 40.08,11.12 40.08,7.92 40.46,7.54 40.62,7.54 40.84,7.32 RN11.2
RGB6  (via drill 0.1)
  Top 0.152: v20.88,38.33 23.24,40.69 24.31,40.69 LED0.2.C1
  Bottom 0.152: v20.88,38.33 17.75,35.2 13.26,35.2 13.03,34.98 RN5.3
RGB7  (via drill 0.1, 0.1 layers 1-2)
  Top 0.152: v28.19,32.16 27.05,33.3 27.05,35.28 LED0.2.C2
  Route2 0.152: v28.19,21.64 v28.19,32.16
  Bottom 0.152: v28.19,21.64 27.89,21.34 26.82,21.34 26.59,21.57 RN7.3
RGB8  (via drill 0.1)
  Top 0.152: v33.07,37.64 32.46,38.25 27.74,38.25 27.05,38.94 27.05,40.69 LED0.2.C3
  Bottom 0.152: v33.07,37.64 41.6,37.64 41.6,7.09 41.22,6.71 41.15,6.71 40.92,6.48 RN11.3
RGB9  (via drill 0.1)
  Top 0.152: v32.08,38.79 33.98,40.69 35.28,40.69 LED0.3.C1
  Bottom 0.152: v32.08,38.79 27.66,34.37 13.26,34.37 13.03,34.14 RN5.4
RGB10  (via drill 0.1, 0.1 layers 1-2)
  Top 0.152: v36.58,32.16 37.95,33.53 37.95,35.28 LED0.3.C2
  Route2 0.152: v32.92,23.01 36.58,26.67 v36.58,32.16
  Bottom 0.152: v32.92,23.01 30.71,23.01 28.73,21.03 26.82,21.03 26.59,20.8 RN7.4
RGB11  (via drill 0.1)
  Top 0.152: v41.91,38.1 41.6,38.41 38.56,38.41 38.02,38.94 38.02,40.69 LED0.3.C3
  Bottom 0.152: v41.91,38.1 41.91,6.55 41.3,5.94 41.15,5.94 40.92,5.71 RN11.4
RGB12  (via drill 0.1)
  Top 0.152: v20.95,32 23.24,29.72 24.31,29.72 LED0.6.C1
  Bottom 0.152: v20.95,32 18.75,32 17.98,32.77 13.34,32.77 13.03,33.07 RN6.1
RGB13  (via drill 0.1, 0.1 layers 1-2)
  Top 0.152: v28.73,26.75 28.57,26.59 27.58,26.59 27.05,26.06 27.05,24.31 LED0.6.C2
  Route2 0.152: v29.87,21.49 28.73,22.63 v28.73,26.75
  Bottom 0.152: v29.87,21.49 28.96,20.57 27.36,20.57 26.59,19.81 RN8.1
RGB14  (via drill 0.1, 0.1 layers 1-2)
  Top 0.152: v26.67,27.28 26.67,29.64 26.98,29.64 LED0.6.C3
  Route2 0.152: v41.6,5.26 26.67,20.19 v26.67,27.28
  Bottom 0.152: v41.6,5.26 41.53,5.26 40.92,4.65 RN12.1
RGB15  (via drill 0.1)
  Top 0.152: v13.72,32.16 13.72,29.72 13.41,29.72 LED0.5.C1
  Bottom 0.152: v13.72,32.16 13.11,32.16 13.03,32.23 RN6.2
RGB16  (via drill 0.1, 0.1 layers 15-16)
  Top 0.152: v21.34,24.92 21.34,26.59 16.61,26.59 16,25.98 LED0.5.C2
  Route15 0.152: v27.28,19.13 21.49,24.92 v21.34,24.92
  Bottom 0.152: v27.28,19.13 26.75,19.13 26.59,18.97 RN8.2
RGB17  (via drill 0.1, 0.1 layers 1-2)
  Top 0.152: v16.08,26.75 16.08,29.64 16,29.64 LED0.5.C3
  Route2 0.152: v18.82,4.8 16.23,7.39 16.23,18.75 18.52,21.03 18.52,24.31 v16.08,26.75
  Bottom 0.152: v18.82,4.8 23.01,0.61 41.45,0.61 41.45,3.35 41.3,3.5 41.22,3.5 40.92,3.81 RN12.2
RGB18  (via drill 0.1)
  Top 0.152: v7.01,32.16 6.86,32 4.65,32 2.36,29.72 LED0.4.C1
  Bottom 0.152: v7.01,32.16 9.37,29.79 12.19,29.79 12.19,30.86 12.5,31.17 12.65,31.17 12.95,31.47 RN6.3
RGB19  (via drill 0.1)
  Top 0.152: v21.87,16.69 20.88,15.7 15.77,15.7 15.24,16.23 v8.69,16.23 | v6.33,21.26 5.03,22.55 5.03,24.23 LED0.4.C2
  Bottom 0.152: v21.87,16.69 22.02,16.54 25.76,16.54 25.76,17.53 26.14,17.91 26.29,17.91 26.52,18.14 RN8.3 | v8.69,16.23 6.33,18.59 v6.33,21.26
RGB20  (via drill 0.1, 0.1 layers 1-2)
  Top 0.152: v3.73,26.75 4.95,27.96 4.95,29.64 LED0.4.C3
  Route2 0.152: v2.67,21.64 3.73,22.71 v3.73,26.75
  Bottom 0.152: v2.67,21.64 2.67,10.82 4.27,9.22 15.09,9.22 23.39,0.91 40.08,0.91 40.08,2.36 40.46,2.74 40.62,2.74 40.84,2.97 RN12.3
RGB21  (via drill 0.1)
  Top 0.152: v32.08,28.96 32.77,29.64 35.28,29.64 LED0.7.C1
  Bottom 0.152: v32.08,28.96 14.71,28.96 13.03,30.63 RN6.4
RGB22  (via drill 0.1)
  Top 0.152: v33.07,21.03 34.06,22.02 37.41,22.02 37.95,22.55 37.95,24.23 LED0.7.C2
  Bottom 0.152: v33.07,21.03 32.46,20.42 31.47,20.42 28.42,17.37 26.59,17.37 RN8.4
RGB23  (via drill 0.1, 0.1 layers 15-16)
  Top 0.152: v39.24,26.82 38.63,27.43 38.56,27.43 38.02,27.96 38.02,29.64 LED0.7.C3
  Route15 0.152: v40.84,1.52 40.16,2.21 40.16,25.91 v39.24,26.82
  Bottom 0.152: v40.84,1.52 40.84,2.21 RN12.4
RGB24  (via drill 0.1, 0.1 layers 1-2)
  Top 0.152: v17.98,21.18 18.21,20.95 22.1,20.95 24.31,18.75 LED0.10.C1
  Route2 0.152: v12.42,26.75 v17.98,21.18
  Bottom 0.152: v12.42,26.75 1.52,26.75 1.52,30.1 RN4.5
RGB25  (via drill 0.1, 0.1 layers 15-16)
  Top 0.152: v21.57,15.47 21.64,15.54 26.44,15.54 26.98,15.01 26.98,13.34 LED0.10.C2
  Route15 0.152: v14.25,16.69 14.63,16.31 v14.63,15.47
  Bottom 0.152: v14.25,16.69 14.86,16.69 15.01,16.84 RN10.5 | v14.63,15.47 v21.57,15.47
RGB26  (via drill 0.1, 0.1 layers 1-2)
  Top 0.152: v28.19,15.77 27.05,16.92 27.05,18.67 LED0.10.C3
  Route2 0.152: v32.08,1.75 28.19,5.64 v28.19,15.77
  Bottom 0.152: v32.08,1.75 31.55,1.22 29.87,1.22 29.41,1.68 RN14.5
RGB27  (via drill 0.1)
  Top 0.152: v8.23,21.87 9.14,20.95 11.12,20.95 13.34,18.75 LED0.9.C1
  Bottom 0.152: v8.23,21.87 7.92,22.17 0.91,22.17 0.91,30.56 1.07,30.71 1.22,30.71 1.45,30.94 RN4.6
RGB28  (via drill 0.1, 0.1 layers 1-2)
  Top 0.152: v11.12,15.7 11.28,15.54 15.47,15.54 15.93,15.09 15.93,13.34 LED0.9.C2
  Route2 0.152: v10.9,16.99 11.12,16.76 v11.12,15.7
  Bottom 0.152: v10.9,16.99 11.28,17.37 14.78,17.37 15.01,17.6 RN10.6
RGB29  (via drill 0.1, 0.1 layers 1-2)
  Top 0.152: v16.76,16.23 16,16.99 16,18.67 LED0.9.C3
  Route2 0.152: v20.5,4.8 16.76,8.53 v16.76,16.23
  Bottom 0.152: v20.5,4.8 22.48,2.82 29.03,2.82 29.34,2.52 RN14.6
RGB30  (via drill 0.1)
  Top 0.152: v0.69,21.72 0.69,18.75 2.29,18.75 LED0.8.C1
  Bottom 0.152: v0.69,21.72 0.61,21.72 0.61,31.01 1.07,31.47 1.22,31.47 1.45,31.7 RN4.7
RGB31  (via drill 0.1, 0.1 layers 1-2)
  Top 0.152: v10.9,12.8 10.9,11.05 5.56,11.05 5.03,11.58 5.03,13.26 LED0.8.C2
  Route2 0.152: v10.9,17.68 11.66,16.92 11.66,13.56 v10.9,12.8
  Bottom 0.152: v10.9,17.68 12.27,17.68 12.72,18.14 14.71,18.14 15.01,18.44 RN10.7
RGB32  (via drill 0.1)
  Top 0.152: v3.2,15.77 3.89,16.46 4.5,16.46 4.95,16.92 4.95,18.67 LED0.8.C3
  Bottom 0.152: v3.2,15.77 3.2,10.74 4.42,9.53 16.46,9.53 22.4,3.58 29.11,3.58 29.34,3.35 RN14.7
RGB33  (via drill 0.1, 0.1 layers 1-2)
  Top 0.152: v25.83,21.18 26.06,20.95 32.46,20.95 34.67,18.75 35.28,18.75 LED0.11.C1
  Route2 0.152: v0.69,32.84 1.6,33.76 1.6,37.87 2.52,38.79 17.3,38.79 17.3,31.7 25.83,23.16 v25.83,21.18
  Bottom 0.152: v0.69,32.84 1.22,32.84 1.45,32.61 RN4.8
RGB34  (via drill 0.1, 0.1 layers 15-16)
  Top 0.152: v32.08,12.19 33.22,11.05 37.49,11.05 37.95,11.51 37.95,13.26 LED0.11.C2
  Route15 0.152: v14.25,18.97 15.16,18.06 v15.16,14.94
  Bottom 0.152: v14.25,18.97 14.78,18.97 15.01,19.2 RN10.8 | v15.16,14.94 16.15,13.95 30.33,13.95 v32.08,12.19
RGB35  (via drill 0.1, 0.1 layers 15-16)
  Top 0.152: v34.98,15.77 35.66,16.46 37.49,16.46 37.95,16.92 37.95,18.67 LED0.11.C3
  Route15 0.152: v30.02,4.65 30.33,4.95 30.33,11.12 v34.98,15.77
  Bottom 0.152: v30.02,4.65 29.95,4.65 29.41,4.12 RN14.8
RGB36  (via drill 0.1, 0.1 layers 1-2)
  Top 0.152: v23.55,10.82 24.31,10.06 24.31,7.77 LED0.14.C1
  Route2 0.152: v2.97,38.25 13.11,38.25 13.11,35.43 23.55,24.99 v23.55,10.82
  Bottom 0.152: v2.97,38.25 0.61,38.25 0.61,34.37 1.07,33.91 1.14,33.91 1.45,33.6 RN3.5
RGB37  (via drill 0.1, 0.1 layers 15-16)
  Top 0.152: v23.24,5.26 23.93,4.57 26.44,4.57 26.98,4.04 26.98,2.36 LED0.14.C2
  Route15 0.152: v14.33,19.74 15.7,18.36 15.7,12.8 v23.24,5.26
  Bottom 0.152: v14.33,19.74 14.48,19.74 15.01,20.27 RN9.5
RGB38  (via drill 0.1)
  Top 0.152: v27.05,5.26 27.05,7.7 LED0.14.C3
  Bottom 0.152: v27.05,5.26 29.26,5.26 29.34,5.18 RN13.5
RGB39  (via drill 0.1, 0.1 layers 1-2)
  Top 0.152: v10.9,9.6 12.72,7.77 13.34,7.77 LED0.13.C1
  Route2 0.152: v2.13,37.72 10.36,29.49 10.36,10.13 v10.9,9.6
  Bottom 0.152: v2.13,37.72 0.91,37.72 0.91,34.82 1.07,34.67 1.22,34.67 1.45,34.44 RN3.6
RGB40  (via drill 0.1, 0.1 layers 1-2)
  Top 0.152: v14.78,5.26 15.93,4.12 15.93,2.36 LED0.13.C2
  Route2 0.152: v14.25,21.11 14.78,20.57 v14.78,5.26
  Bottom 0.152: v14.25,21.11 15.01,21.11 RN9.6
RGB41  (via drill 0.1)
  Top 0.152: v21.87,5.94 21.26,5.33 16.69,5.33 16,6.02 LED0.13.C3
  Bottom 0.152: v21.87,5.94 29.34,5.94 RN13.6
RGB42  (via drill 0.1, 0.1 layers 1-2)
  Top 0.152: v2.06,10.82 2.06,7.77 2.29,7.77 LED0.12.C1
  Route2 0.152: v2.06,10.82 v2.06,27.28
  Bottom 0.152: v2.06,27.28 2.06,34.75 1.91,34.9 1.75,34.9 1.52,35.13 RN3.7
RGB43  (via drill 0.1, 0.1 layers 1-2)
  Top 0.152: v5.71,4.72 5.03,4.04 5.03,2.36 LED0.12.C2
  Route2 0.152: v13.18,21.11 12.27,20.19 12.27,10.06 6.93,4.72 v5.71,4.72
  Bottom 0.152: v13.18,21.11 13.72,21.64 14.78,21.64 15.01,21.87 RN9.7
RGB44  (via drill 0.1)
  Top 0.152: v21.72,8.99 20.57,10.13 5.71,10.13 5.03,9.45 5.03,7.77 LED0.12.C3
  Bottom 0.152: v21.72,8.99 23.7,7.01 29.11,7.01 29.34,6.78 RN13.7
RGB45  (via drill 0.1, 0.1 layers 1-2)
  Top 0.152: v27.74,5.26 27.89,5.41 32.99,5.41 35.28,7.7 LED0.15.C1
  Route2 0.152: v3.43,37.72 14.4,26.75 15.54,26.75 15.54,26.9 15.93,27.28 20.8,27.28 20.8,21.64 23.01,19.43 23.01,9.98 v27.74,5.26
  Bottom 0.152: v3.43,37.72 3.2,37.72 1.52,36.04 RN3.8
RGB46  (via drill 0.1, 0.1 layers 15-16)
  Top 0.152: v36.96,4.88 37.26,4.57 37.41,4.57 37.95,4.04 37.95,2.36 LED0.15.C2
  Route15 0.152: v30.86,10.97 v36.96,4.88
  Bottom 0.152: v30.86,10.97 28.19,13.64 15.77,13.64 14.48,14.94 10.29,14.94 10.29,21.72 11.28,22.71 15.01,22.71 RN9.8
RGB47  (via drill 0.1, 0.1 layers 15-16)
  Top 0.152: v33.83,5.26 33.98,5.41 37.41,5.41 37.95,5.94 37.95,7.7 LED0.15.C3
  Route15 0.152: v30.86,8.23 v33.83,5.26
  Bottom 0.152: v30.86,8.23 30.1,8.23 29.41,7.54 RN13.8
SCL  (via drill 0.1, 0.1 layers 15-16)
  Top 0.152: v34.14,15.77 33.53,16.38 v33.07,16.38
  Route15 0.152: v16.15,24.23 13.72,21.79 v13.72,20.65 13.72,20.57 14.17,20.57 16,18.75 16,18.29 19.55,14.74 | v6.25,35.2 13.11,28.35 v13.11,26.75 | 19.55,14.74 v22.02,12.27 | 19.55,14.74 v19.58,14.78
  Bottom 0.152: v34.14,15.77 34.14,10.59 33.6,10.06 32.46,10.06 32.23,9.83 DRV_B.26 | JP3.2 33.07,18.67 v33.07,16.38 33.07,14.78 v19.58,14.78 | v13.72,20.65 11.73,18.67 11.51,18.67 JP4.3 | DRV_G.26 17.83,24.92 16.84,24.92 v16.15,24.23 16.15,24.31 15.54,24.31 v13.11,26.75 | v6.25,35.2 6.25,36.73 5.03,37.95 4.57,37.95 4.34,38.18 DRV_R.26 | v22.02,12.27 22.17,12.27 22.94,11.51 JP6.3
SDA  (via drill 0.1 layers 15-16)
  Route15 0.152: v16.99,26.21 v7.09,36.12 | v15.7,24.84 v13.03,22.17 12.65,21.79 12.65,16.08 v14.33,14.4
  Bottom 0.152: JP3.3 31.47,21.26 31.77,21.57 33.22,21.57 33.6,21.18 33.6,10.52 32.16,10.52 DRV_B.27 32.16,10.44 28.96,10.44 26.59,12.8 21.72,12.8 20.42,11.51 JP6.2 20.34,11.51 18.52,13.34 15.39,13.34 v14.33,14.4 | v7.09,36.12 7.09,36.35 4.8,38.63 4.57,38.63 4.34,38.86 DRV_R.27 | DRV_G.27 17.83,25.6 17.6,25.6 v16.99,26.21 16.99,26.14 v15.7,24.84 | v13.03,22.17 12.5,22.17 11.51,21.18 JP4.2

### Text on the board
bPlace: R | A4 | A0 | G | GND | GND | SDA | SDA | SCL | SCL | 5V | 5V | B | GND | SDA | SCL | 5V